# Altium schematic sheet RX.SchDoc
size 420 x 297 mm; SheetNumber: 4; SheetTotal: 4
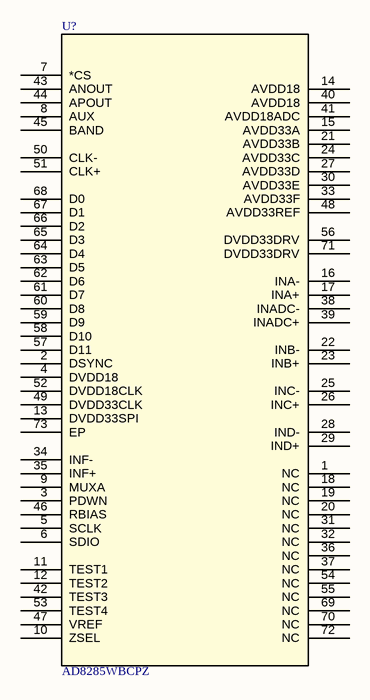
[diagram p0: RX.SchDoc]

## Parts
U?  AD8285WBCPZ  [CP_72_5_ADI]

## Nets

Not connected (* = marked no-connect by the designer): U? 1(NC) 2(DSYNC) 3(PDWN) 4(DVDD18) 5(SCLK) 6(SDIO) 7(*CS) 8(AUX) 9(MUXA) 10(ZSEL) 11(TEST1) 12(TEST2) 13(DVDD33SPI) 14(AVDD18) 15(AVDD33A) 16(INA-) 17(INA+) 18(NC) 19(NC) 20(NC) 21(AVDD33B) 22(INB-) 23(INB+) 24(AVDD33C) 25(INC-) 26(INC+) 27(AVDD33D) 28(IND-) 29(IND+) 30(AVDD33E) 31(NC) 32(NC) 33(AVDD33F) 34(INF-) 35(INF+) 36(NC) 37(NC) 38(INADC-) 39(INADC+) 40(AVDD18) 41(AVDD18ADC) 42(TEST3) 43(ANOUT) 44(APOUT) 45(BAND) 46(RBIAS) 47(VREF) 48(AVDD33REF) 49(DVDD33CLK) 50(CLK-) 51(CLK+) 52(DVDD18CLK) 53(TEST4) 54(NC) 55(NC) 56(DVDD33DRV) 57(D11) 58(D10) 59(D9) 60(D8) 61(D7) 62(D6) 63(D5) 64(D4) 65(D3) 66(D2) 67(D1) 68(D0) 69(NC) 70(NC) 71(DVDD33DRV) 72(NC) 73(EP)

## Notes on the sheet
- THIS DOCUMENT AND THE DATA DISCLOSED HEREIN OR
- HEREWITH IS THE PROPERTY OF ALTIUM LIMITED AND MAY
- DWG NO:
- REVISION
- REV:
- DESCRIPTION
- DATE
- APPROVED
- BE FREELY DISTRIBUTED IN WHOLE. NO RIGHTS ARE
- RESERVED OR EXPRESS OR IMPLIED WARANTEE GIVEN.
- ENG:
- APPROVALS
- PROJECT
- DSN:
- CHK:
- REFERENCE DOCUMENTS
- PROJECT REVISION:
- TITLE
- DOCUMENT REVISION:
- DESIGN ITEM:
- BOM:
- FAB DWG:
- PCB DWG:
- ASSY DWG:
- SCALE:
- A3
- SIZE
- CAGE CODE
- FILE NAME
- DWG NO.
- SHEET
- OF
- REV

## Library data of the parts
U? = AD8285WBCPZ: Radar Receive Path AFE: 4-Channel LNA/PGA/AAF with ADC; Manufacturer_Name: Analog Devices Inc; Copyright: Copyright (C) 2026 Ultra Librarian. All rights reserved.; Manufacturer_Part_Number: AD8285WBCPZ; Datasheet: https://www.analog.com/media/en/technical-documentation/data-sheets/AD8285.pdf; RefDes: RefDes; Type: Type